# Altium schematic sheet TDA5340.SchDoc
size A4
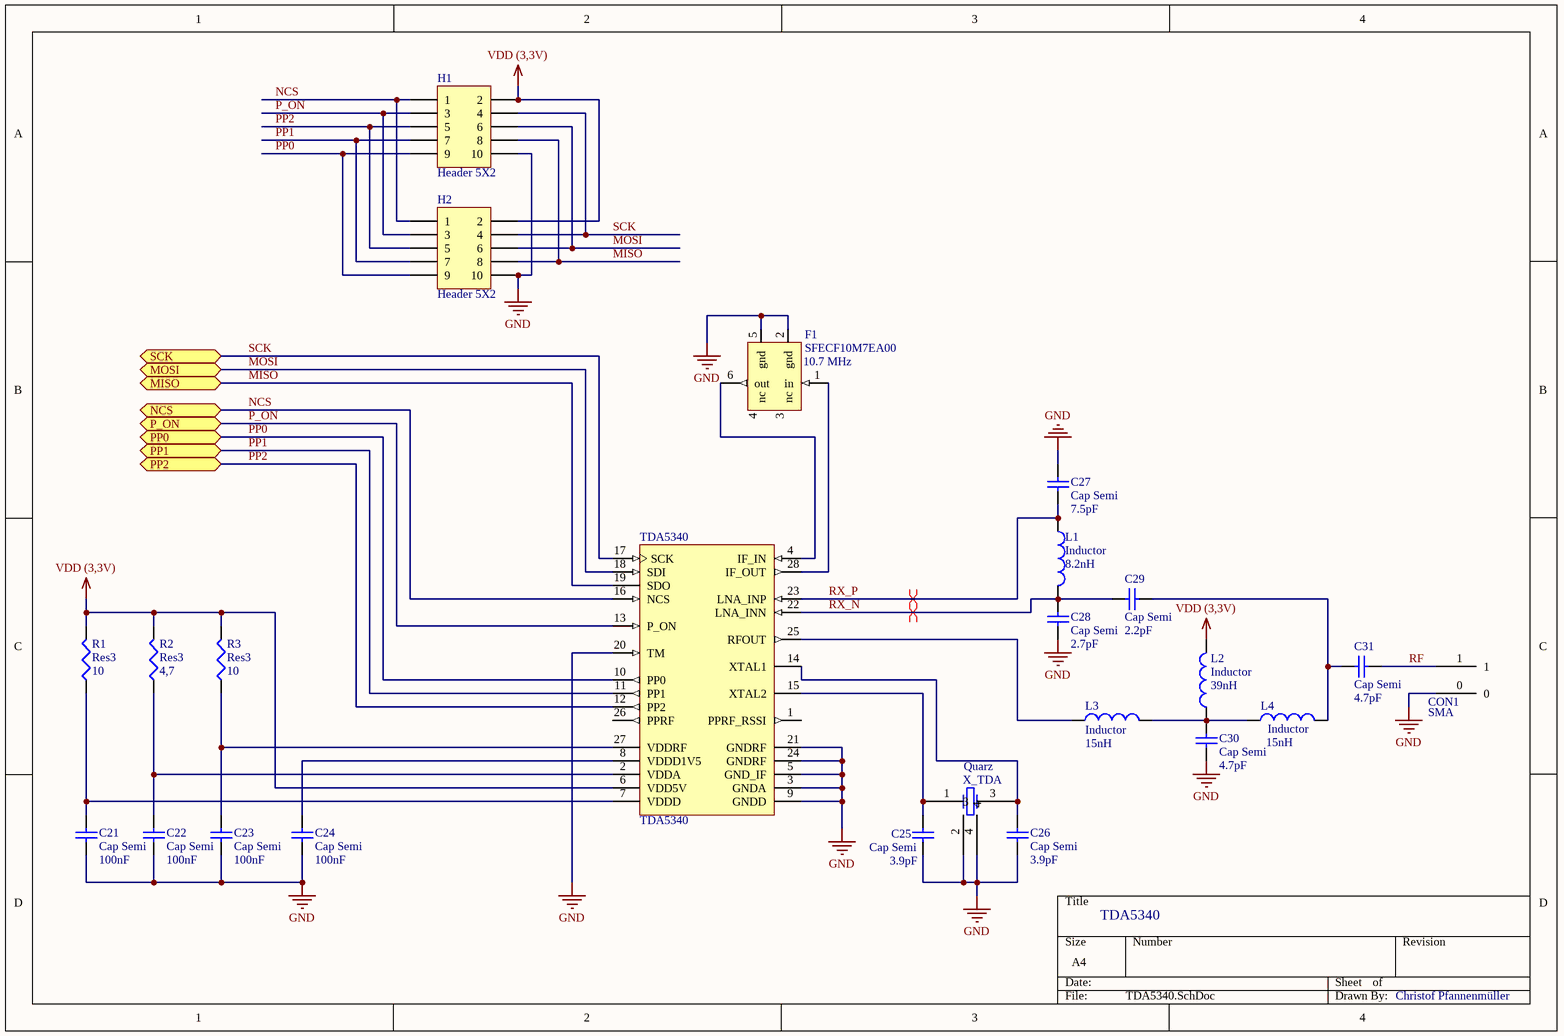
[diagram p0: TDA5340.SchDoc]

## Parts
C21  Cap Semi  value 100nF  [0402]
C22  Cap Semi  value 100nF  [0402]
C23  Cap Semi  value 100nF  [0402]
C24  Cap Semi  value 100nF  [0402]
C25  Cap Semi  value 3.9pF  [0402]
C26  Cap Semi  value 3.9pF  [0402]
C27  Cap Semi  value 7.5pF  [0402]
C28  Cap Semi  value 2.7pF  [0402]
C29  Cap Semi  value 2.2pF  [0402]
C30  Cap Semi  value 4.7pF  [0402]
C31  Cap Semi  value 4.7pF  [0402]
CON1  SMA  [SMA]
F1  SFECF10M7EA00  Frequenz: 10.7 MHz  [SOP6]
H1  Header 5X2  [HDR2X5]
H2  Header 5X2  [HDR2X5]
L1  Inductor  value 8.2nH  [INDC1608L]
L2  Inductor  value 39nH  [INDC1608L]
L3  Inductor  value 15nH  [INDC1608L]
L4  Inductor  value 15nH  [INDC1608L]
R1  Res3  value 10  [J1-0603]
R2  Res3  value 4,7  [J1-0603]
R3  Res3  value 10  [J1-0603]
TDA5340  TDA5340  [INF-PG-TSSOP-28_N]
X_TDA  Quarz  [Quarz]

## Ports
MISO, MOSI, NCS, P_ON, PP0, PP1, PP2, SCK

## Nets
GND: C21.2 C22.2 C23.2 C24.2 C25.2 C26.1 C27.1 C28.2 C30.1 CON1.0 F1.2(gnd) F1.5(gnd) H1.10 H2.10 TDA5340.3(GNDA) TDA5340.5(GND_IF) TDA5340.9(GNDD) TDA5340.20(TM) TDA5340.21(GNDRF) TDA5340.24(GNDRF) X_TDA.2 X_TDA.4
VDD (3,3V): H1.2 H2.2 L2.2 R1.2 R2.2 R3.2 TDA5340.6(VDD5V)
MISO: H1.8 H2.8 TDA5340.19(SDO) ; port MISO
MOSI: H1.6 H2.6 TDA5340.18(SDI) ; port MOSI
NCS: H1.1 H2.1 TDA5340.16(NCS) ; port NCS
P_ON: H1.3 H2.3 TDA5340.13(P_ON) ; port P_ON
PP0: H1.9 H2.9 TDA5340.10(PP0) ; port PP0
PP1: H1.7 H2.7 TDA5340.11(PP1) ; port PP1
PP2: H1.5 H2.5 TDA5340.12(PP2) ; port PP2
RF: C31.2 CON1.1
RX_N: C28.1 C29.2 L1.2 TDA5340.22(LNA_INN)
RX_P: C27.2 L1.1 TDA5340.23(LNA_INP)
SCK: H1.4 H2.4 TDA5340.17(SCK) ; port SCK
NetC21_1: C21.1 R1.1 TDA5340.7(VDDD)
NetC22_1: C22.1 R2.1 TDA5340.2(VDDA)
NetC23_1: C23.1 R3.1 TDA5340.27(VDDRF)
NetC24_1: C24.1 TDA5340.8(VDDD1V5)
NetC25_1: C25.1 TDA5340.15(XTAL2) X_TDA.1
NetC26_2: C26.2 TDA5340.14(XTAL1) X_TDA.3
NetC29_1: C29.1 C31.1 L4.2
NetC30_2: C30.2 L2.1 L3.2 L4.1
NetF1_1: F1.1(in) TDA5340.28(IF_OUT)
NetF1_6: F1.6(out) TDA5340.4(IF_IN)
NetL3_1: L3.1 TDA5340.25(RFOUT)

Not connected (* = marked no-connect by the designer): F1 3(nc) 4(nc); TDA5340 1(PPRF_RSSI) 26(PPRF)

## Layout directives
differential pair: RX_N, RX_P

## Notes on the sheet
- TDA5340
- Christof Pfannenmüller

## Library data of the parts
C21-C31 = Cap Semi: Capacitor (Semiconductor SIM Model); Published: 8-Jun-2000; LatestRevisionDate: 29-May-2009; LatestRevisionNote: IPC-7351 Footprint Added.; PackageReference: C0402; Publisher: Altium Limited; PackageDescription: Chip Capacitor
F1 = SFECF10M7EA00: Typ: Ceramic Filter
H1 H2 = Header 5X2: Header, 5-Pin, Dual row; LatestRevisionDate: 17-Jul-2002; LatestRevisionNote: Re-released for DXP Platform.; Publisher: Altium Limited
L1-L4 = Inductor: Code_IEC: 1005; Published: 8-Jun-2000; LatestRevisionDate: 29-May-2009; LatestRevisionNote: IPC-7351 Footprint Added.; PackageReference: 0402-A; Publisher: Altium Limited; PackageDescription: Chip Inductor; Code_JEITA: 0402
R1-R3 = Res3: Resistor; Published: 8-Jun-2000; LatestRevisionDate: 29-May-2009; LatestRevisionNote: IPC-7351 Footprint Added.; PackageReference: J1-0603; Publisher: Altium Limited; PackageDescription: Chip Resistor
TDA5340 = TDA5340: High Sensitivity Multi-Channel Transceiver, -40 to 110 degC, PG-TSSOP-28, Green; Manufacturer: Infineon; Frequency Band: 315 MHz, 434 MHz, 470 MHz, 868 MHz, 915 MHz, 959 MHz; Green: yes; Group: SmartLEWIS TRX to Multi-channel TRX with Digital Baseband Processing; Modulation Type: ASK / FSK / GSFK; Transmit Power (at 3V): 14 dBm; DatasheetVersion: Rev. 1.2; PackageReference: PG-TSSOP-28; PackageDescription: 28-Pin Plastic (Green) Thin Shrink Small Outline Package, 9.7 x 4.4 mm Body, 0.65 mm Pitch; Supplier 1: Mouser; Supplier Part Number 1: N/A; Channel Requirements per Band: Multi-Channel; Halogen-free: yes; Mounting Technology: Surface Mount; PartNumber: TDA5340; ComponentLink1Description: Manufacturer URL; ComponentLink1URL: http://www.infineon.com/; ComponentLink2Description: Datasheet; ComponentLink2URL: http://www.infineon.com/dgdl/TDA5340_DS_V1.2.pdf?folderId=db3a3043191a246301192dd387ea2ae3&fileId=db3a30433408410401340ea9a6a4300a; ComponentLink3Description: Package Specification; ComponentLink3URL: http://www.infineon.com/cms/packages/SMD_-_Surface_Mounted_Devices/P-PG-TSSOP/P-PG-TSSOP-28-1x_-4x_-8.html?__locale=en